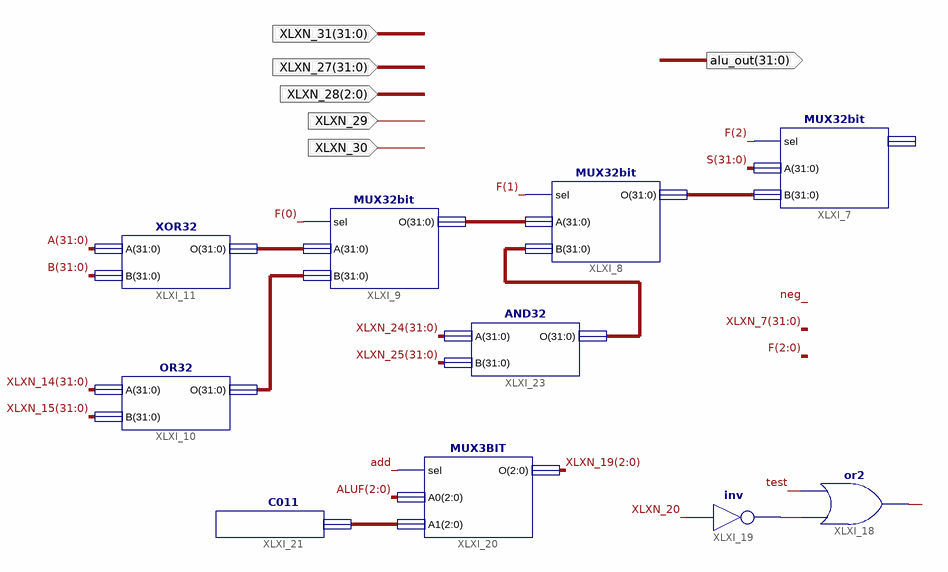
[diagram p0: schematic sheet 1]
// Xilinx ISE schematic ALU2.sch (spartan6) as structural Verilog: 10 symbols, 6 ports
module ALU2 (
  input  [31:0] XLXN_27,
  input  [2:0] XLXN_28,
  input  XLXN_29,
  input  XLXN_30,
  input  [31:0] XLXN_31,
  output [31:0] alu_out
);

  wire add, test, XLXN_20, XLXN_23, XLXN_28_1bit;
  wire [2:0] ALUF, F, XLXN_19, XLXN_22;
  wire [31:0] A, B, S, XLXN_1, XLXN_2, XLXN_3, XLXN_9, XLXN_14, XLXN_15, XLXN_24, XLXN_25, XLXN_44;

  MUX32bit XLXI_7 (.sel(F[2]), .A(S), .B(XLXN_44));  // open: O
  MUX32bit XLXI_8 (.sel(F[1]), .A(XLXN_3), .B(XLXN_9), .O(XLXN_44));
  OR32 XLXI_10 (.A(XLXN_14), .B(XLXN_15), .O(XLXN_2));
  MUX32bit XLXI_9 (.sel(F[0]), .A(XLXN_1), .B(XLXN_2), .O(XLXN_3));
  XOR32 XLXI_11 (.A(A), .B(B), .O(XLXN_1));
  or XLXI_18 (XLXN_23, XLXN_28_1bit, test);
  not XLXI_19 (XLXN_28_1bit, XLXN_20);
  MUX3BIT XLXI_20 (.sel(add), .A0(ALUF), .A1(XLXN_22), .O(XLXN_19));
  C011 XLXI_21 (.C011_Out(XLXN_22));
  AND32 XLXI_23 (.A(XLXN_24), .B(XLXN_25), .O(XLXN_9));
endmodule
